# EAGLE design LE1-4 (EAGLE 8.5.1)
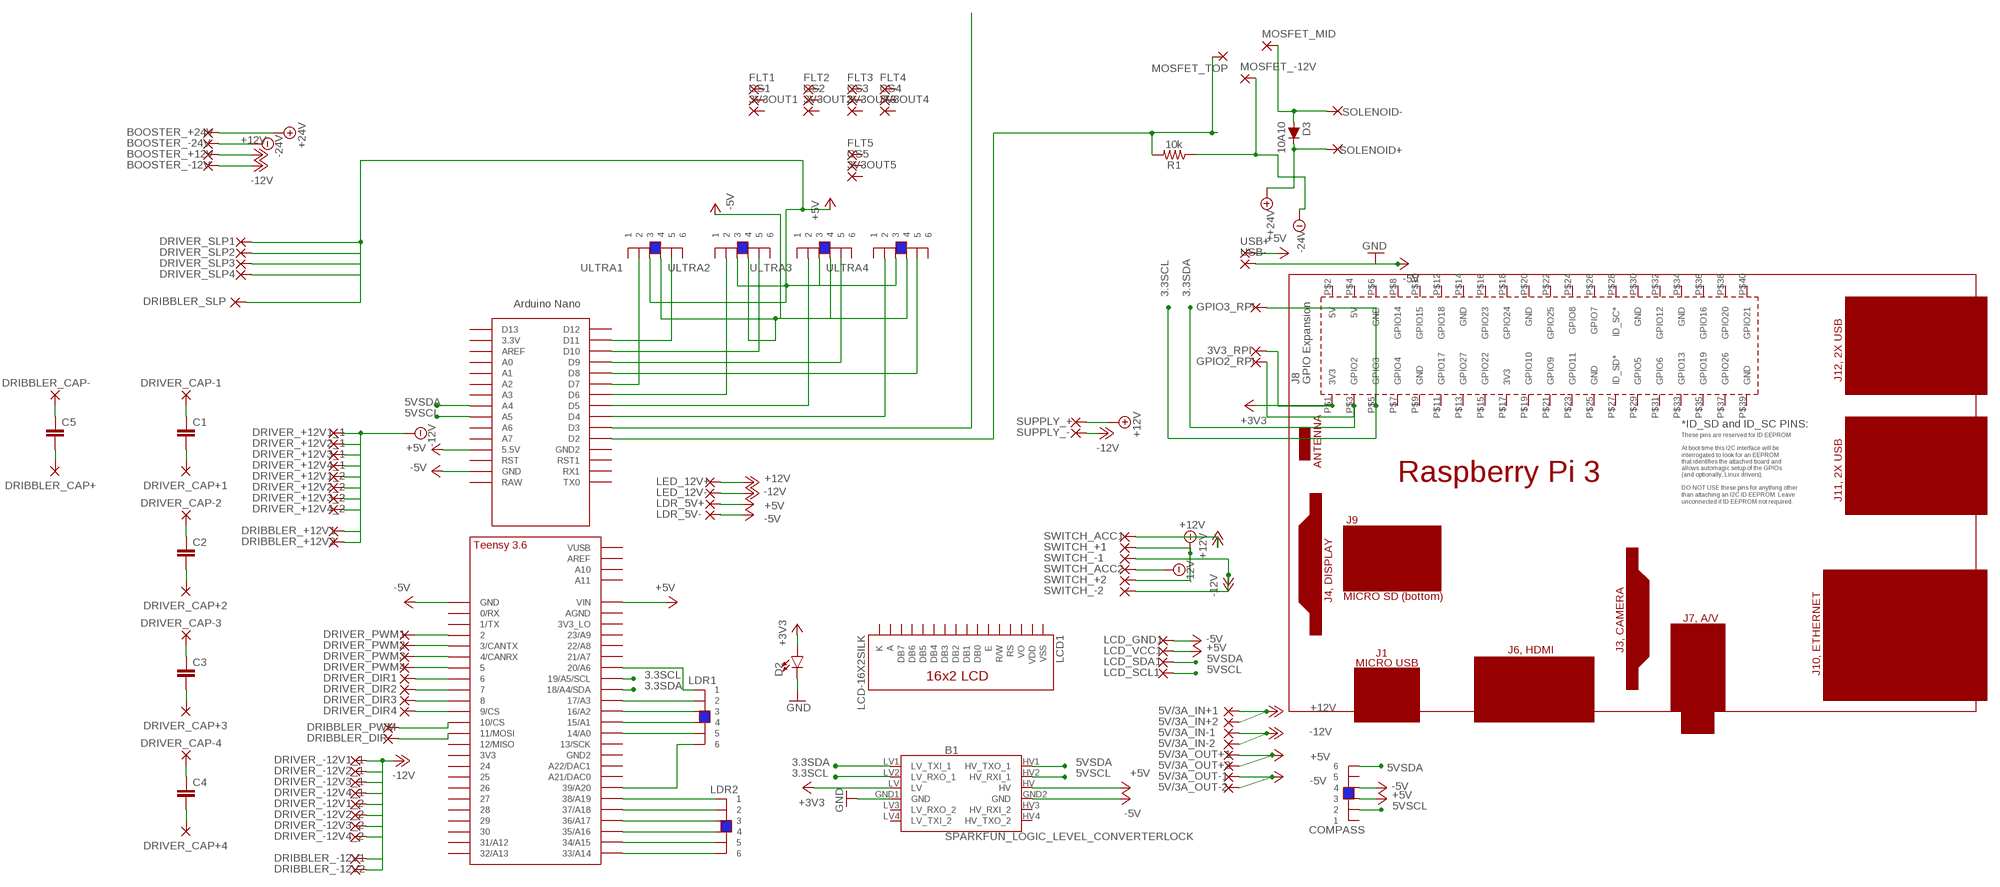
[diagram p0: schematic, sheet 1]

## Parts
3V3_RPI  2,54/1,0  [2,54/1,0]
3V3OUT1  2,54/1,0  [2,54/1,0]
3V3OUT2  2,54/1,0  [2,54/1,0]
3V3OUT3  2,54/1,0  [2,54/1,0]
3V3OUT4  2,54/1,0  [2,54/1,0]
3V3OUT5  2,54/1,0  [2,54/1,0]
5V/3A_IN+1  WIREPAD2,54/1,0  [2,54/1,0]
5V/3A_IN+2  WIREPAD2,54/1,0  [2,54/1,0]
5V/3A_IN-1  WIREPAD2,54/1,0  [2,54/1,0]
5V/3A_IN-2  WIREPAD2,54/1,0  [2,54/1,0]
5V/3A_OUT+1  WIREPAD2,54/1,0  [2,54/1,0]
5V/3A_OUT+2  WIREPAD2,54/1,0  [2,54/1,0]
5V/3A_OUT-1  WIREPAD2,54/1,0  [2,54/1,0]
5V/3A_OUT-2  WIREPAD2,54/1,0  [2,54/1,0]
B1  SPARKFUN_LOGIC_LEVEL_CONVERTERLOCK  [SPARKFUN_LOGIC_LEVEL_CONVERTER_LOCK]
BOOSTER_+12V  WIREPAD2,54/1,0  [2,54/1,0]
BOOSTER_+24V  WIREPAD2,54/1,0  [2,54/1,0]
BOOSTER_-12V  WIREPAD2,54/1,0  [2,54/1,0]
BOOSTER_-24V  WIREPAD2,54/1,0  [2,54/1,0]
C1  C5/7.2  [C5B7.2]
C2  C5/7.2  [C5B7.2]
C3  C5/7.2  [C5B7.2]
C4  C5/7.2  [C5B7.2]
C5  C5/7.2  [C5B7.2]
COMPASS  6P6C_FEMALESMD  [6P6C_FEMALE]
CS1  2,54/1,0  [2,54/1,0]
CS2  2,54/1,0  [2,54/1,0]
CS3  2,54/1,0  [2,54/1,0]
CS4  2,54/1,0  [2,54/1,0]
CS5  2,54/1,0  [2,54/1,0]
D2  LED-3MM-NO_SILK  [LED_3MM-NS]
D3  10A10  DIODE-1N4148  [DIODE-1N4148]
DRIBBLER_+12V1  WIREPAD2,54/1,0  [2,54/1,0]
DRIBBLER_+12V2  WIREPAD2,54/1,0  [2,54/1,0]
DRIBBLER_-12V1  WIREPAD2,54/1,0  [2,54/1,0]
DRIBBLER_-12V2  WIREPAD2,54/1,0  [2,54/1,0]
DRIBBLER_CAP+  2,54/1,0  [2,54/1,0]
DRIBBLER_CAP-  2,54/1,0  [2,54/1,0]
DRIBBLER_DIR  WIREPAD2,54/1,0  [2,54/1,0]
DRIBBLER_PWM  WIREPAD2,54/1,0  [2,54/1,0]
DRIBBLER_SLP  WIREPAD2,54/1,0  [2,54/1,0]
DRIVER_+12V1_1  WIREPAD2,54/1,0  [2,54/1,0]
DRIVER_+12V1_2  WIREPAD2,54/1,0  [2,54/1,0]
DRIVER_+12V2_1  WIREPAD2,54/1,0  [2,54/1,0]
DRIVER_+12V2_2  WIREPAD2,54/1,0  [2,54/1,0]
DRIVER_+12V3_1  WIREPAD2,54/1,0  [2,54/1,0]
DRIVER_+12V3_2  WIREPAD2,54/1,0  [2,54/1,0]
DRIVER_+12V4_1  WIREPAD2,54/1,0  [2,54/1,0]
DRIVER_+12V4_2  WIREPAD2,54/1,0  [2,54/1,0]
DRIVER_-12V1_1  WIREPAD2,54/1,0  [2,54/1,0]
DRIVER_-12V1_2  WIREPAD2,54/1,0  [2,54/1,0]
DRIVER_-12V2_1  WIREPAD2,54/1,0  [2,54/1,0]
DRIVER_-12V2_2  WIREPAD2,54/1,0  [2,54/1,0]
DRIVER_-12V3_1  WIREPAD2,54/1,0  [2,54/1,0]
DRIVER_-12V3_2  WIREPAD2,54/1,0  [2,54/1,0]
DRIVER_-12V4_1  WIREPAD2,54/1,0  [2,54/1,0]
DRIVER_-12V4_2  WIREPAD2,54/1,0  [2,54/1,0]
DRIVER_CAP+1  2,54/1,0  [2,54/1,0]
DRIVER_CAP+2  2,54/1,0  [2,54/1,0]
DRIVER_CAP+3  2,54/1,0  [2,54/1,0]
DRIVER_CAP+4  2,54/1,0  [2,54/1,0]
DRIVER_CAP-1  2,54/1,0  [2,54/1,0]
DRIVER_CAP-2  2,54/1,0  [2,54/1,0]
DRIVER_CAP-3  2,54/1,0  [2,54/1,0]
DRIVER_CAP-4  2,54/1,0  [2,54/1,0]
DRIVER_DIR1  WIREPAD2,54/1,0  [2,54/1,0]
DRIVER_DIR2  WIREPAD2,54/1,0  [2,54/1,0]
DRIVER_DIR3  WIREPAD2,54/1,0  [2,54/1,0]
DRIVER_DIR4  WIREPAD2,54/1,0  [2,54/1,0]
DRIVER_PWM1  WIREPAD2,54/1,0  [2,54/1,0]
DRIVER_PWM2  WIREPAD2,54/1,0  [2,54/1,0]
DRIVER_PWM3  WIREPAD2,54/1,0  [2,54/1,0]
DRIVER_PWM4  WIREPAD2,54/1,0  [2,54/1,0]
DRIVER_SLP1  WIREPAD2,54/1,0  [2,54/1,0]
DRIVER_SLP2  WIREPAD2,54/1,0  [2,54/1,0]
DRIVER_SLP3  WIREPAD2,54/1,0  [2,54/1,0]
DRIVER_SLP4  WIREPAD2,54/1,0  [2,54/1,0]
FLT1  2,54/1,0  [2,54/1,0]
FLT2  2,54/1,0  [2,54/1,0]
FLT3  2,54/1,0  [2,54/1,0]
FLT4  2,54/1,0  [2,54/1,0]
FLT5  2,54/1,0  [2,54/1,0]
GPIO2_RPI  2,54/1,0  [2,54/1,0]
GPIO3_RPI  2,54/1,0  [2,54/1,0]
LCD1  LCD-16X2SILK  [LCD-16X2]
LCD_GND1  WIREPAD2,54/1,0  [2,54/1,0]
LCD_SCL1  WIREPAD2,54/1,0  [2,54/1,0]
LCD_SDA1  WIREPAD2,54/1,0  [2,54/1,0]
LCD_VCC1  WIREPAD2,54/1,0  [2,54/1,0]
LDR1  6P6C_FEMALESMD  [6P6C_FEMALE]
LDR2  6P6C_FEMALESMD  [6P6C_FEMALE]
LDR_5V+  2,54/1,0  [2,54/1,0]
LDR_5V-  2,54/1,0  [2,54/1,0]
LED_12V+  2,54/1,0  [2,54/1,0]
LED_12V-  2,54/1,0  [2,54/1,0]
MOSFET_-12V  2,54/1,0  [2,54/1,0]
MOSFET_MID  2,54/1,0  [2,54/1,0]
MOSFET_TOP  2,54/1,0  [2,54/1,0]
PCB1  RPI3  [RPI3]
R1  10k  10KOHM-HORIZ-1/4W-1%  [AXIAL-0.3]
SOLENOID+  2,54/1,0  [2,54/1,0]
SOLENOID-  2,54/1,0  [2,54/1,0]
SUPPLY_+  WIREPAD2,54/1,0  [2,54/1,0]
SUPPLY_-  WIREPAD2,54/1,0  [2,54/1,0]
SWITCH_+1  WIREPAD2,54/1,0  [2,54/1,0]
SWITCH_+2  WIREPAD2,54/1,0  [2,54/1,0]
SWITCH_-1  WIREPAD2,54/1,0  [2,54/1,0]
SWITCH_-2  WIREPAD2,54/1,0  [2,54/1,0]
SWITCH_ACC1  WIREPAD2,54/1,0  [2,54/1,0]
SWITCH_ACC2  WIREPAD2,54/1,0  [2,54/1,0]
U$1  TEENSY_3.5/3.6_BASIC  [TEENSY_3.5/3.6_BASIC]
U$2  NANO  [NANO]
ULTRA1  6P6C_FEMALESMD  [6P6C_FEMALE]
ULTRA2  6P6C_FEMALESMD  [6P6C_FEMALE]
ULTRA3  6P6C_FEMALESMD  [6P6C_FEMALE]
ULTRA4  6P6C_FEMALESMD  [6P6C_FEMALE]
USB+  2,54/1,0  [2,54/1,0]
USB-  2,54/1,0  [2,54/1,0]

## Nets
3.3SCL: B1.LV2(LV_RXO_1) GPIO3_RPI.1(P) PCB1.P$5(GPIO3) U$1.19/A5/SCL
3.3SDA: B1.LV1(LV_TXI_1) GPIO2_RPI.1(P) PCB1.P$3(GPIO2) U$1.18/A4/SDA
5VSCL: B1.HV2(HV_RXI_1) LCD_SCL1.1(P) U$2.A5
5VSDA: B1.HV1(HV_TXO_1) LCD_SDA1.1(P) U$2.A4
+3V3: 3V3_RPI.1(P) B1.LV D2.A PCB1.P$1(3V3)
+5V: 5V/3A_OUT+1.1(P) 5V/3A_OUT+2.1(P) B1.HV COMPASS.3 DRIBBLER_SLP.1(P) DRIVER_SLP1.1(P) DRIVER_SLP2.1(P) DRIVER_SLP3.1(P) DRIVER_SLP4.1(P) LCD_VCC1.1(P) LDR_5V+.1(P) U$1.VIN U$2.5V(5.5V) ULTRA1.3 ULTRA2.3 ULTRA3.3 ULTRA4.3 USB+.1(P)
+12V: 5V/3A_IN+1.1(P) 5V/3A_IN+2.1(P) BOOSTER_+12V.1(P) D3.C LED_12V+.1(P) SOLENOID+.1(P) SUPPLY_+.1(P) SWITCH_+1.1(P) SWITCH_+2.1(P) SWITCH_ACC1.1(P) ; supply symbol labelled +24V
+24V: BOOSTER_+24V.1(P)
-5V: 5V/3A_OUT-1.1(P) 5V/3A_OUT-2.1(P) B1.GND2(GND) COMPASS.4 LCD_GND1.1(P) LDR_5V-.1(P) U$1.GND U$2.GND ULTRA1.4 ULTRA2.4 ULTRA3.4 ULTRA4.4
-12V: 5V/3A_IN-1.1(P) 5V/3A_IN-2.1(P) BOOSTER_-12V.1(P) DRIBBLER_+12V1.1(P) DRIBBLER_+12V2.1(P) DRIBBLER_-12V1.1(P) DRIBBLER_-12V2.1(P) DRIVER_+12V1_1.1(P) DRIVER_+12V1_2.1(P) DRIVER_+12V2_1.1(P) DRIVER_+12V2_2.1(P) DRIVER_+12V3_1.1(P) DRIVER_+12V3_2.1(P) DRIVER_+12V4_1.1(P) DRIVER_+12V4_2.1(P) DRIVER_-12V1_1.1(P) DRIVER_-12V1_2.1(P) DRIVER_-12V2_1.1(P) DRIVER_-12V2_2.1(P) DRIVER_-12V3_1.1(P) DRIVER_-12V3_2.1(P) DRIVER_-12V4_1.1(P) DRIVER_-12V4_2.1(P) LED_12V-.1(P) MOSFET_-12V.1(P) R1.P$1 SUPPLY_-.1(P) SWITCH_-1.1(P) SWITCH_-2.1(P) SWITCH_ACC2.1(P) ; supply symbol labelled -24V
-24V: BOOSTER_-24V.1(P)
GND: B1.GND1(GND) D2.K(C) USB-.1(P) ; supply symbol labelled -5V
N$1: LDR1.6 U$1.39/A20
N$2: DRIBBLER_PWM.1(P) U$1.10/CS
N$3: DRIBBLER_DIR.1(P) U$1.11/MOSI
N$4: DRIVER_PWM1.1(P) U$1.2
N$5: DRIVER_PWM2.1(P) U$1.3/CANTX
N$6: LDR1.2 U$1.17/A3
N$7: LDR1.3 U$1.16/A2
N$8: LDR1.4 U$1.15/A1
N$9: LDR1.5 U$1.14/A0
N$10: LDR1.1 U$1.20/A6
N$11: DRIVER_PWM3.1(P) U$1.4/CANRX
N$12: D3.A MOSFET_MID.1(P) SOLENOID-.1(P)
N$13: MOSFET_TOP.1(P) R1.P$2 U$2.D2
N$14: DRIVER_PWM4.1(P) U$1.5
N$15: U$2.D3
N$16: C5.1 DRIBBLER_CAP-.1(P)
N$17: DRIVER_DIR1.1(P) U$1.6
N$18: LDR2.1 U$1.38/A19
N$19: LDR2.2 U$1.37/A18
N$20: LDR2.3 U$1.36/A17
N$21: LDR2.4 U$1.35/A16
N$22: LDR2.5 U$1.34/A15
N$23: LDR2.6 U$1.33/A14
N$24: DRIVER_DIR2.1(P) U$1.7
N$25: DRIVER_DIR3.1(P) U$1.8
N$26: DRIVER_DIR4.1(P) U$1.9/CS
N$27: C5.2 DRIBBLER_CAP+.1(P)
N$28: U$2.D11 ULTRA1.5
N$29: U$2.D10 ULTRA2.5
N$30: U$2.D9 ULTRA3.5
N$31: C1.1 DRIVER_CAP-1.1(P)
N$32: C1.2 DRIVER_CAP+1.1(P)
N$33: C2.1 DRIVER_CAP-2.1(P)
N$34: C2.2 DRIVER_CAP+2.1(P)
N$35: C3.1 DRIVER_CAP-3.1(P)
N$36: C3.2 DRIVER_CAP+3.1(P)
N$37: C4.1 DRIVER_CAP-4.1(P)
N$38: C4.2 DRIVER_CAP+4.1(P)
N$39: U$2.D8 ULTRA4.5
N$40: U$2.D7 ULTRA1.2
N$41: U$2.D6 ULTRA2.2
N$42: U$2.D5 ULTRA3.2
N$43: U$2.D4 ULTRA4.2
Unconnected: 3V3OUT1.1(P) 3V3OUT2.1(P) 3V3OUT3.1(P) 3V3OUT4.1(P) 3V3OUT5.1(P) B1.HV3(HV_RXI_2) B1.HV4(HV_TXO_2) B1.LV3(LV_RXO_2) B1.LV4(LV_TXI_2) COMPASS.1 COMPASS.2 COMPASS.5 COMPASS.6 CS1.1(P) CS2.1(P) CS3.1(P) CS4.1(P) CS5.1(P) FLT1.1(P) FLT2.1(P) FLT3.1(P) FLT4.1(P) FLT5.1(P) LCD1.3(VO) LCD1.4(RS) LCD1.5(R/W) LCD1.6(E) LCD1.7(DB0) LCD1.8(DB1) LCD1.9(DB2) LCD1.10(DB3) LCD1.11(DB4) LCD1.12(DB5) LCD1.13(DB6) LCD1.14(DB7) PCB1.P$2(5V) PCB1.P$4(5V) PCB1.P$6(GND) PCB1.P$7(GPIO4) PCB1.P$8(GPIO14) PCB1.P$9(GND) PCB1.P$10(GPIO15) PCB1.P$11(GPIO17) PCB1.P$12(GPIO18) PCB1.P$13(GPIO27) PCB1.P$14(GND) PCB1.P$15(GPIO22) PCB1.P$16(GPIO23) PCB1.P$17(3V3) PCB1.P$18(GPIO24) PCB1.P$19(GPIO10) PCB1.P$20(GND) PCB1.P$21(GPIO9) PCB1.P$22(GPIO25) PCB1.P$23(GPIO11) PCB1.P$24(GPIO8) PCB1.P$25(GND) PCB1.P$26(GPIO7) PCB1.P$27(ID_SD*) PCB1.P$28(ID_SC*) PCB1.P$29(GPIO5) PCB1.P$30(GND) PCB1.P$31(GPIO6) PCB1.P$32(GPIO12) PCB1.P$33(GPIO13) PCB1.P$34(GND) PCB1.P$35(GPIO19) PCB1.P$36(GPIO16) PCB1.P$37(GPIO26) PCB1.P$38(GPIO20) PCB1.P$39(GND) PCB1.P$40(GPIO21) U$1.0/RX U$1.1/TX U$1.3V3 U$1.3V3_LO U$1.12/MISO U$1.13/SCK U$1.21/A7 U$1.21/DAC0(A21/DAC0) U$1.22/A8 U$1.23/A9 U$1.24 U$1.25 U$1.26 U$1.27 U$1.28 U$1.29 U$1.30 U$1.31/A12 U$1.32/A13 U$1.A10 U$1.A11 U$1.A22/DAC1 U$1.AGND U$1.AREF U$1.GND2 U$1.VUSB U$2.3.3V U$2.A0 U$2.A1 U$2.A2 U$2.A3 U$2.A6 U$2.A7 U$2.AREF U$2.D12 U$2.D13 U$2.GND1(GND2) U$2.ICSP1 U$2.ICSP2 U$2.ICSP3 U$2.ICSP4 U$2.ICSP5 U$2.ICSP6 U$2.RAW U$2.RST U$2.RST1 U$2.RX1 U$2.TX0 ULTRA1.1 ULTRA1.6 ULTRA2.1 ULTRA2.6 ULTRA3.1 ULTRA3.6 ULTRA4.1 ULTRA4.6

## Power pins joined to a net without a drawn wire
A: LCD1.15(A)
K: LCD1.16(K)
VDD: LCD1.2(VDD)
VSS: LCD1.1(VSS)

## Library data of the parts
3V3_RPI 3V3OUT1-3V3OUT5 CS1-CS5 DRIBBLER_CAP+ DRIBBLER_CAP- DRIVER_CAP+1-DRIVER_CAP+4 DRIVER_CAP-1-DRIVER_CAP-4 FLT1-FLT5 GPIO2_RPI GPIO3_RPI LDR_5V+ LDR_5V- LED_12V+ LED_12V- MOSFET_-12V MOSFET_MID MOSFET_TOP SOLENOID+ SOLENOID- USB+ USB- = wirepad:2,54/1,0: THROUGH-HOLE PAD
5V/3A_IN+1 5V/3A_IN+2 5V/3A_IN-1 5V/3A_IN-2 5V/3A_OUT+1 5V/3A_OUT+2 5V/3A_OUT-1 5V/3A_OUT-2 BOOSTER_+12V BOOSTER_+24V BOOSTER_-12V BOOSTER_-24V DRIBBLER_+12V1 DRIBBLER_+12V2 DRIBBLER_-12V1 DRIBBLER_-12V2 DRIBBLER_DIR DRIBBLER_PWM DRIBBLER_SLP DRIVER_+12V1_1 DRIVER_+12V1_2 DRIVER_+12V2_1 DRIVER_+12V2_2 DRIVER_+12V3_1 DRIVER_+12V3_2 DRIVER_+12V4_1 DRIVER_+12V4_2 DRIVER_-12V1_1 DRIVER_-12V1_2 DRIVER_-12V2_1 DRIVER_-12V2_2 DRIVER_-12V3_1 DRIVER_-12V3_2 DRIVER_-12V4_1 DRIVER_-12V4_2 DRIVER_DIR1-DRIVER_DIR4 DRIVER_PWM1-DRIVER_PWM4 DRIVER_SLP1-DRIVER_SLP4 LCD_GND1 LCD_SCL1 LCD_SDA1 LCD_VCC1 SUPPLY_+ SUPPLY_- SWITCH_+1 SWITCH_+2 SWITCH_-1 SWITCH_-2 SWITCH_ACC1 SWITCH_ACC2 = wirepad:WIREPAD: Wire PAD connect wire on PCB
B1 = SparkFun-Boards:SPARKFUN_LOGIC_LEVEL_CONVERTER: SparkFun Logic Level Converter -Bi-Directional This is the mechnical outline for the 3.3V - 5V bi directional logic level converter. *Note, the "LOCK" Package has the header pins staggered by an offset of 5 mils (off center line), so that when you slide a row of standard 0.1" headers into the PTH pads, it will hold position vertically. See the follwing turorial for more information on this type of special footprints: Sneaky Footprints <https://www.sparkfun.com/tutorials/114> SparkFun Products: SparkFun Logic Level Converter - Bi-Directional <https://www.sparkfun.com/products/12009>
C1-C5 = capacitor-wima:C: CAPACITOR naming: grid - package width
COMPASS LDR1 LDR2 ULTRA1-ULTRA4 = Yijiano:6P6C_FEMALE
D2 = SparkFun-LED:LED: LED (Generic) Standard schematic elements and footprints for 5mm, 3mm, 1206, and 0603 sized LEDs. Generic LEDs with no color specified.
D3 = SparkFun-DiscreteSemi:DIODE: Diode These are standard reverse protection diodes and small signal diodes. SparkFun Products: SparkFun SparkPunk Sound Kit <https://www.sparkfun.com/products/11177> SparkFun ESP8266 Thing <https://www.sparkfun.com/products/13231>; PROD_ID: DIO-08378; VALUE: 200mA/100V/1V
LCD1 = SparkFun-Displays:LCD-16X2: Standard text-only 16x2 parallel input LCD Basic 16 character by 2 line display. Typically utilizes the extremely common HD44780 parallel interface chipset SparkFun Products: Basic 16x2 Green <https://www.sparkfun.com/products/255> Basic 8x2 Green <https://www.sparkfun.com/products/11122>; SF_ID: LCD-00255
PCB1 = e14_Rpi3_RevA:RPI3: Device for Raspberry Pi 3 board created by Dave Young for www.element14.com More information and support community is available at https://www.element14.com/community/community/raspberry-pi
R1 = SparkFun-Resistors:10KOHM: 10kΩ resistor A resistor is a passive two-terminal electrical component that implements electrical resistance as a circuit element. Resistors act to reduce current flow, and, at the same time, act to lower voltage levels within circuits. - Wikipedia; PROD_ID: RES-12183
U$1 = Teensy356:TEENSY_3.5/3.6_BASIC
U$2 = Arduino-clone:NANO: Arduino Nano

## Board
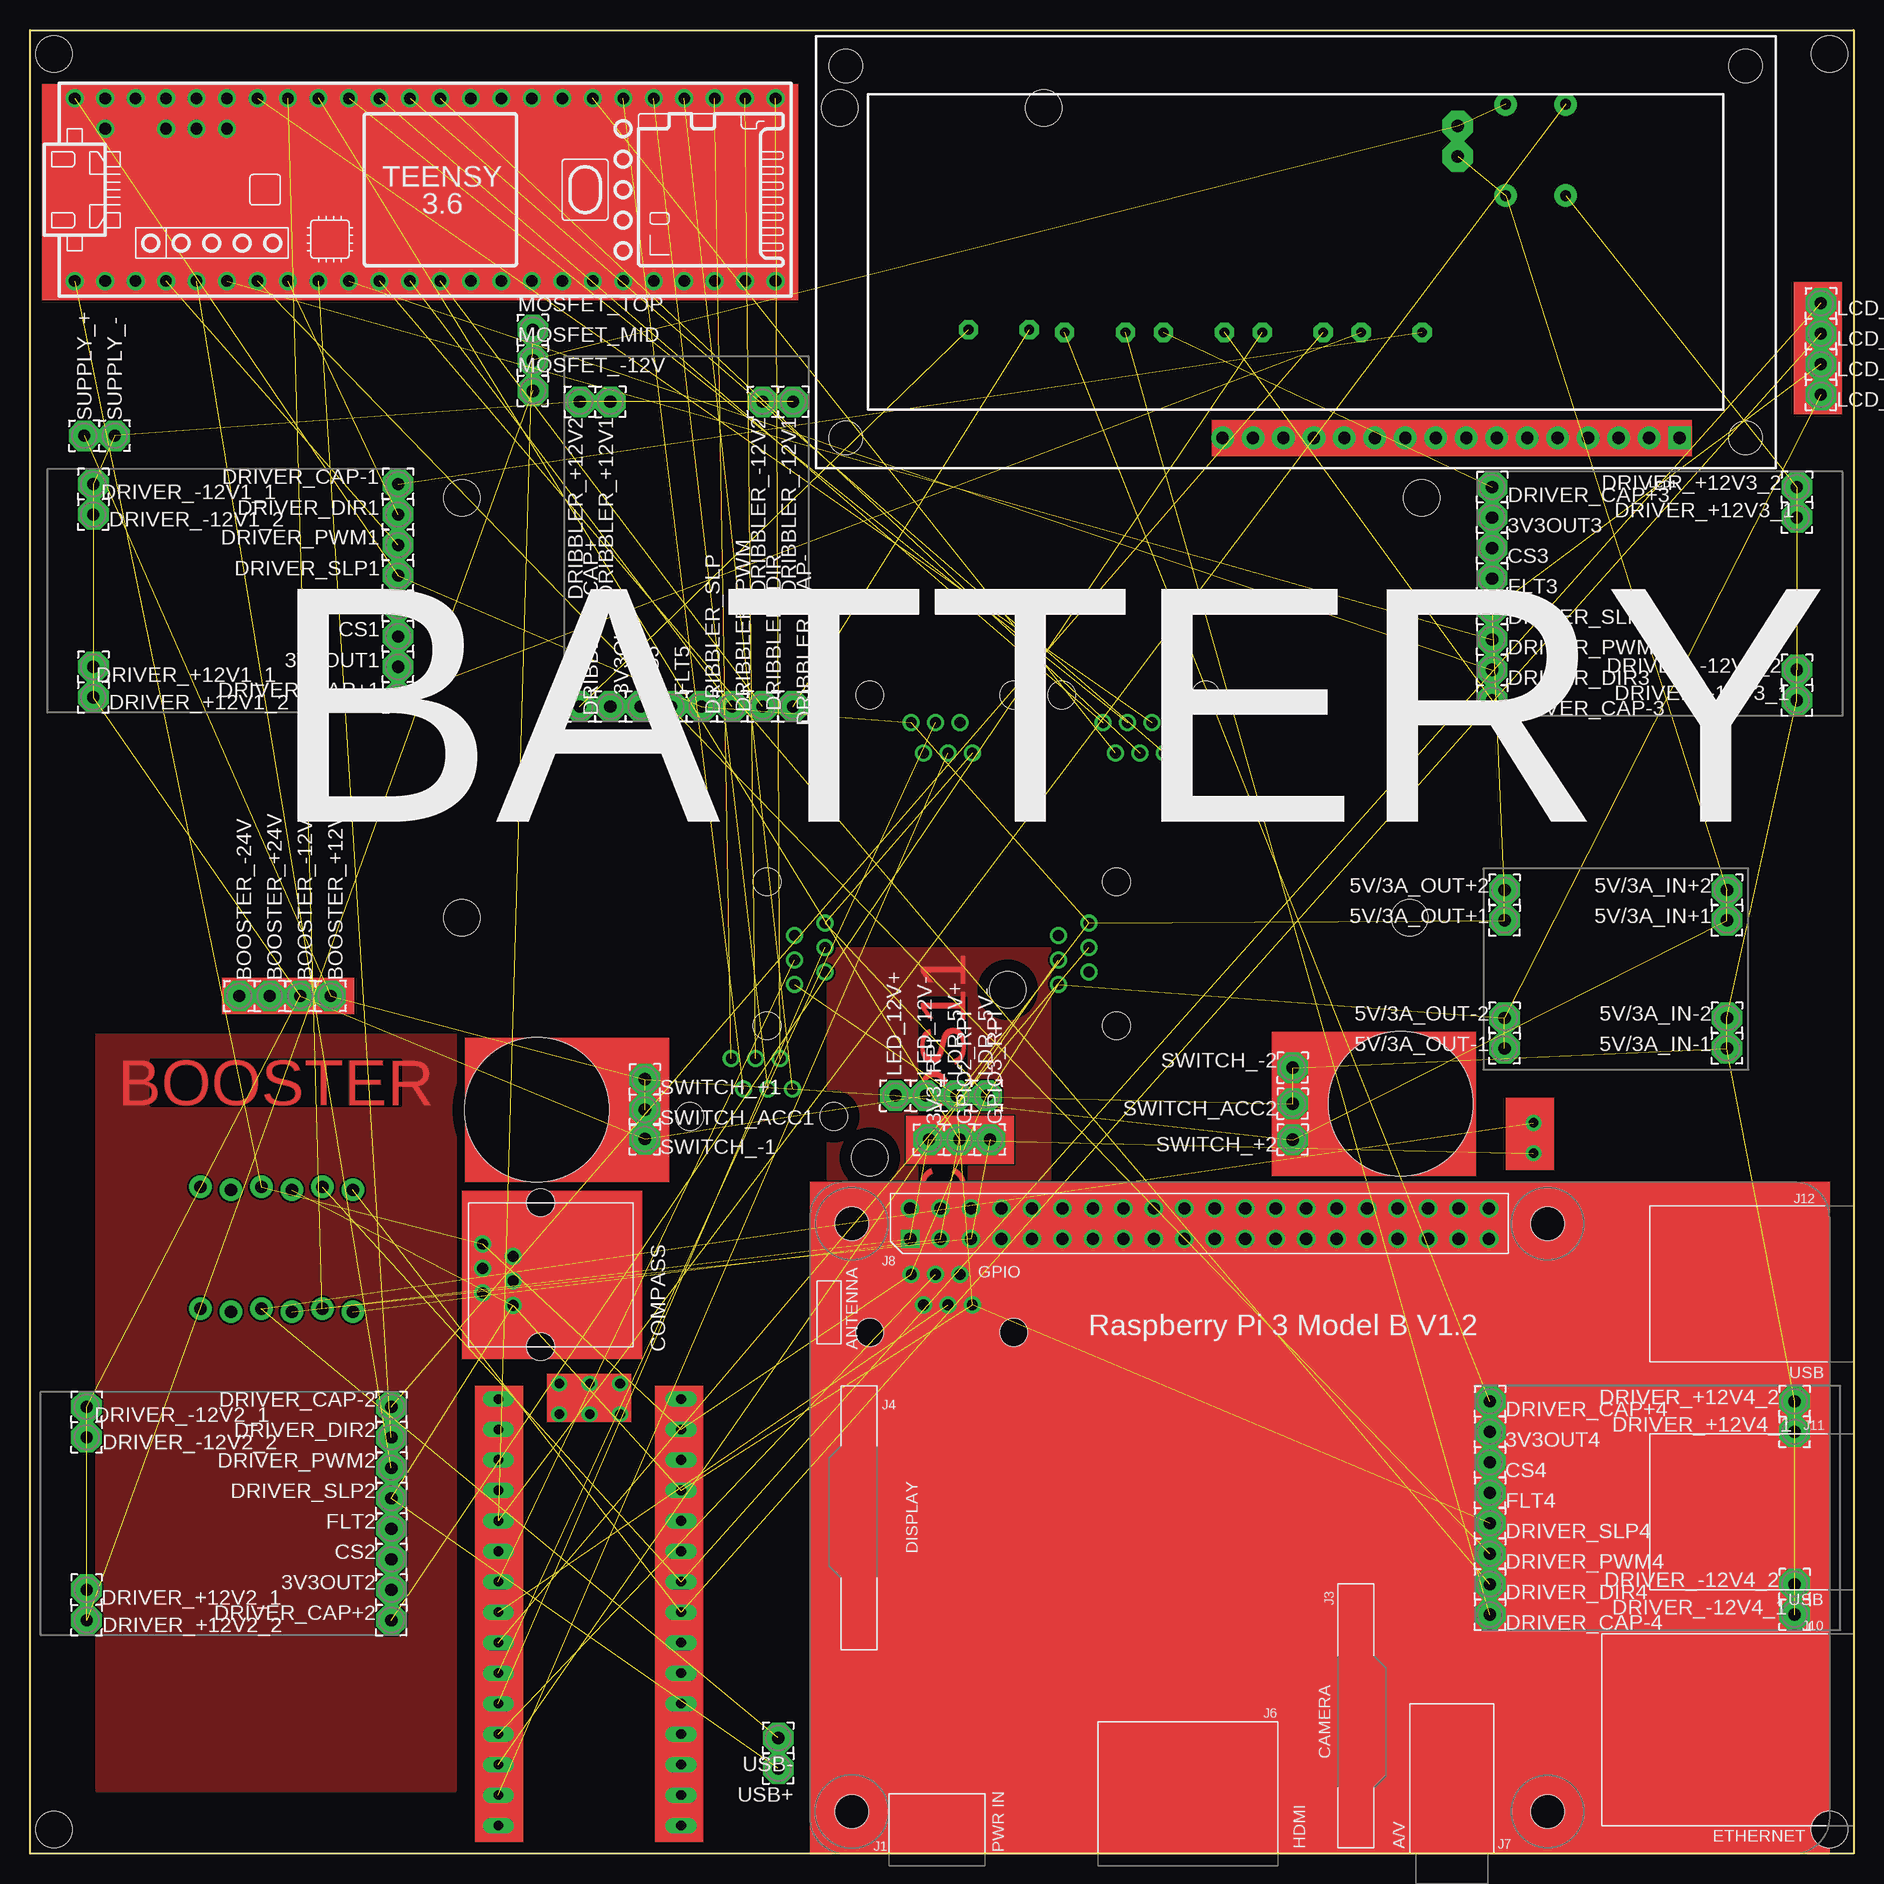
[diagram p1: board, top side]
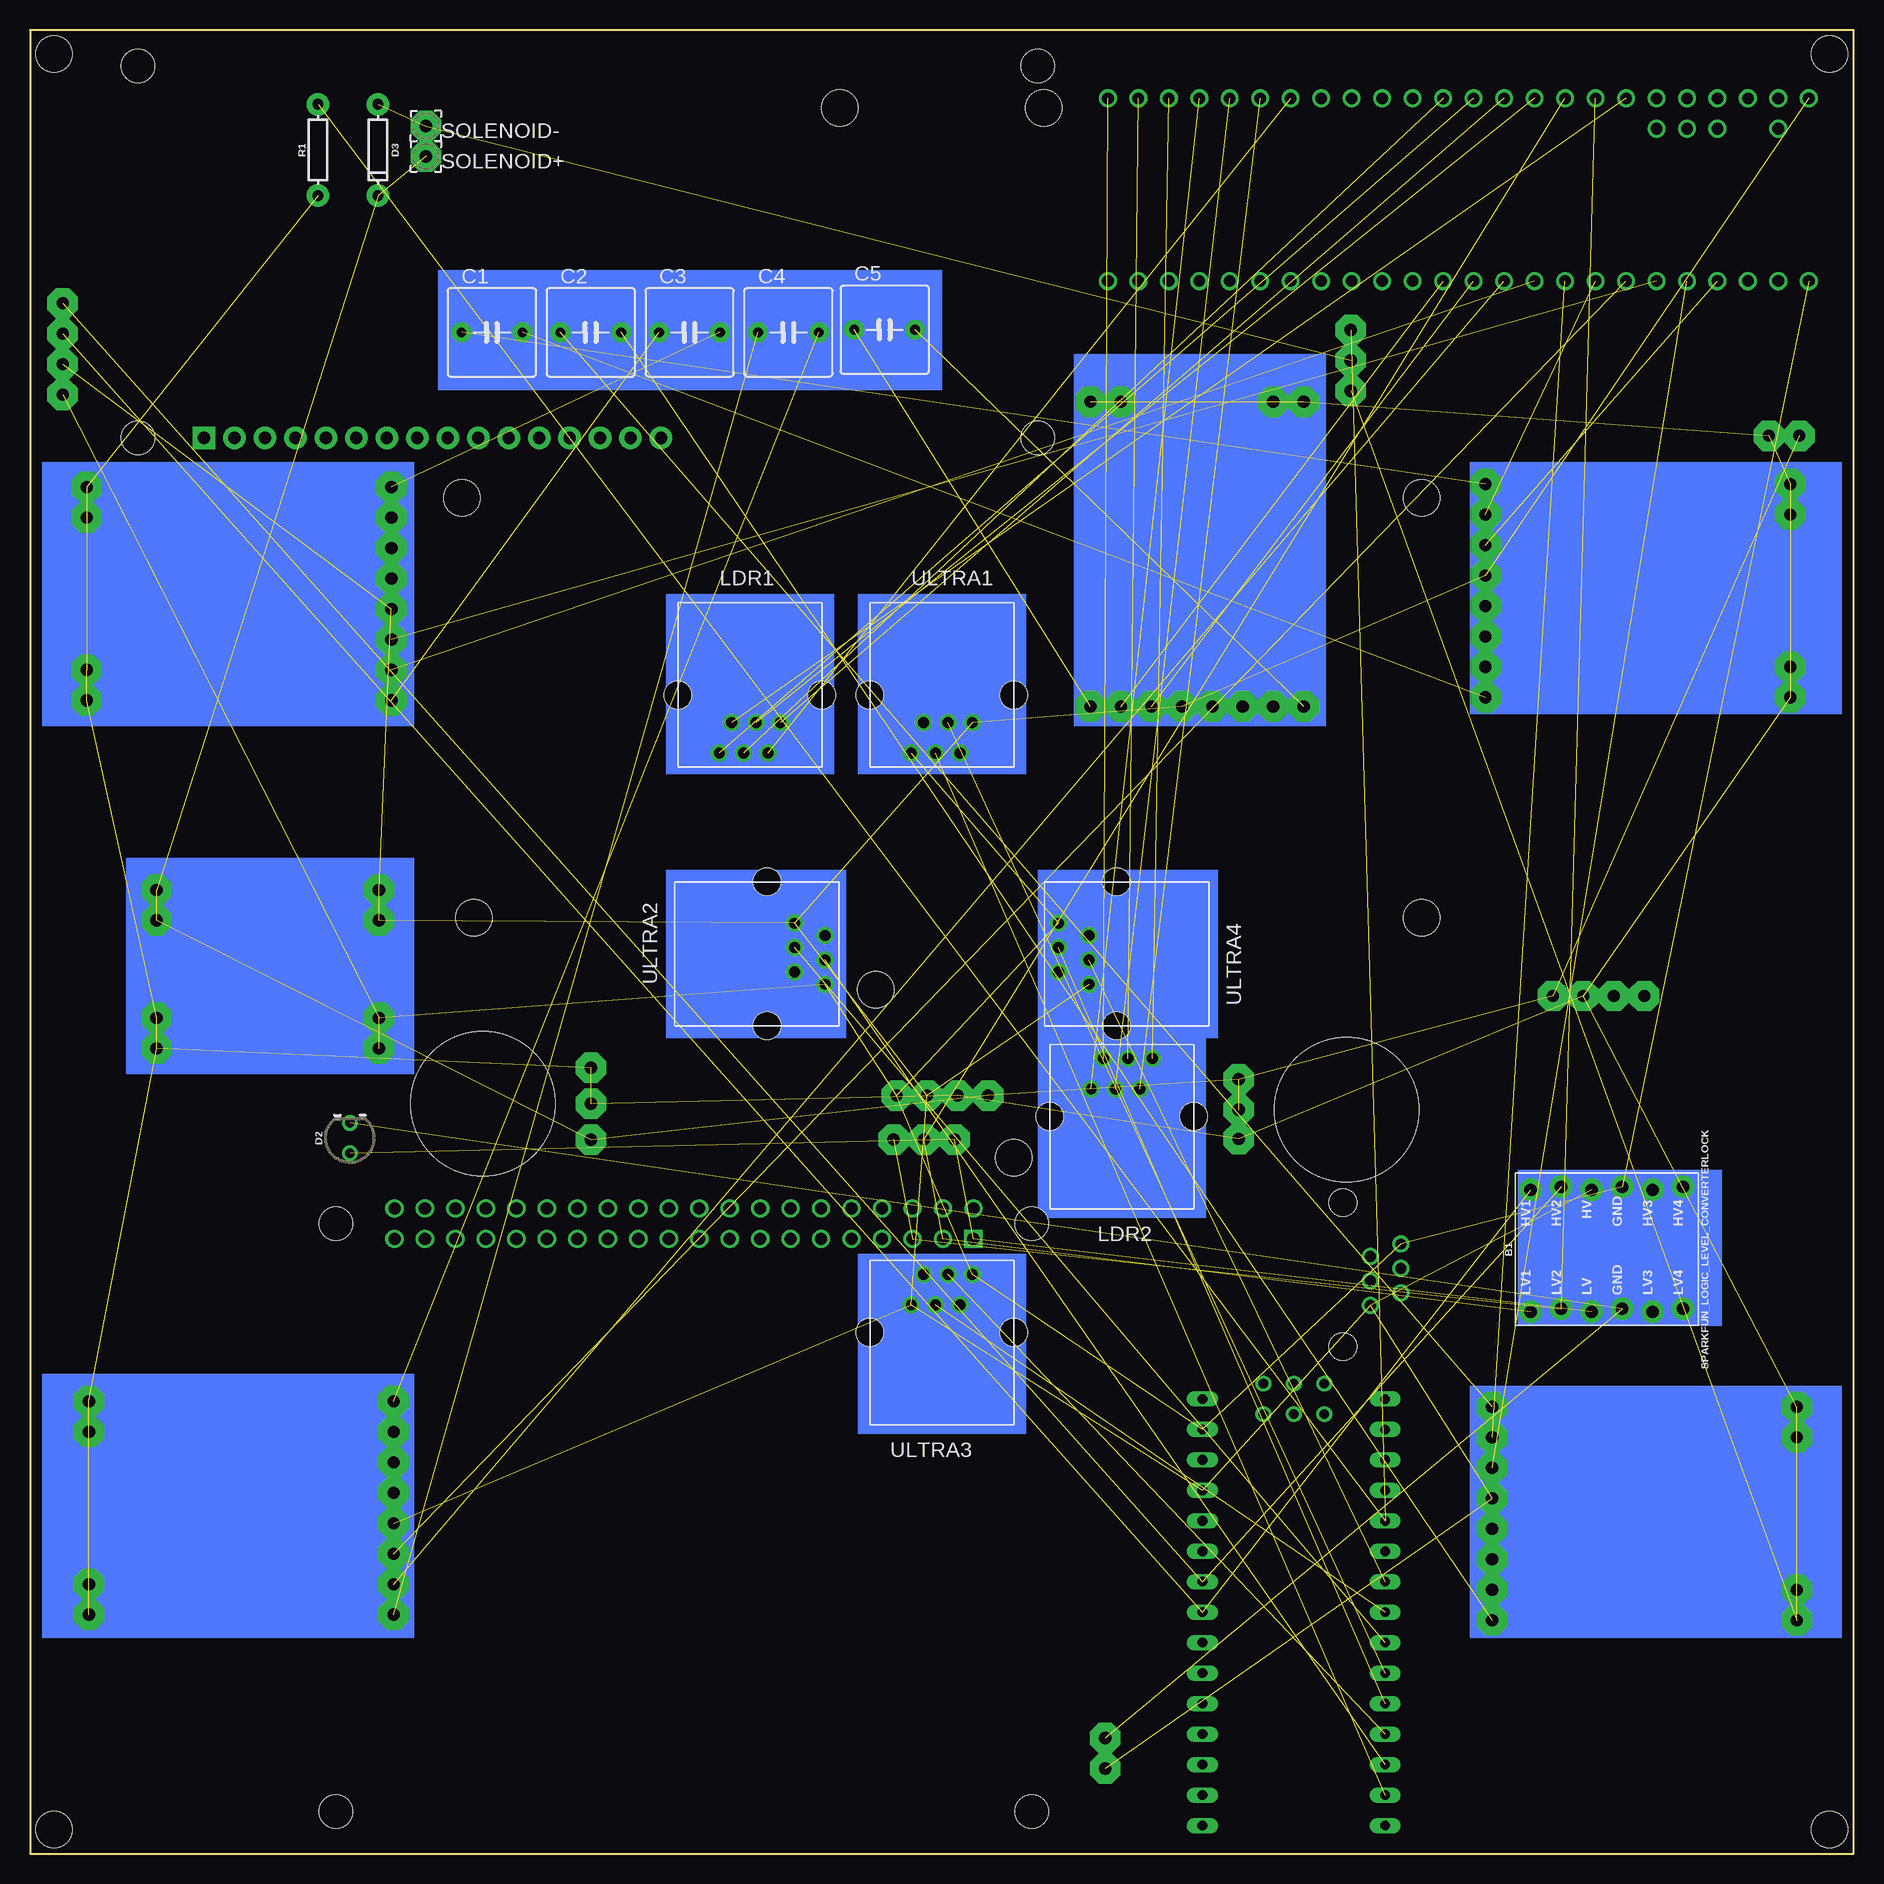
[diagram p2: board, bottom side, seen from below]

Size 152 x 152 mm. Coordinates in mm from the lower left corner, seen from the top.
Outline: 0,0 0,152 152,152 152,0 0,0
Copper layers (1*16): Top 0.035mm / dielectric 1.5mm / Bottom 0.035mm
Design rules "default": minimum track width 6mil, minimum drill 0.35mm, track to track 6mil, track to pad 6mil, pad to pad 6mil, via to via 6mil, smd to smd 6mil, copper to edge 40mil, drill to drill 6mil, minimum pad ring 10mil, minimum via ring 8mil, stop-mask expansion 4mil, vias tented up to drill 0mil, thermal gap 10mil
Holes 12 mm at 42.25,62 114.25,62.5
Holes 3 mm at 2,150 150,150 150,2 2,2 81.5,72 70,58 115,78 116,113 36,113 36,78 67.5,145.5 84.5,145.5

### Footprints (pad centres in the part's own frame; a part is rotated, then mirrored left to right if it is on the bottom)
2,54/1,0 = drill 1.016 pad 2.54 octagon: 1 0,0
SPARKFUN_LOGIC_LEVEL_CONVERTER_LOCK = drill 1.016 pad 1.88: GND1 -4.953,-1.27; GND2 5.207,-1.27; HV 4.953,1.27; HV1 4.953,6.35; HV2 5.207,3.81; HV3 4.953,-3.81; HV4 5.207,-6.35; LV -5.207,1.27; LV1 -5.207,6.35; LV2 -4.953,3.81; LV3 -5.207,-3.81; LV4 -4.953,-6.35
C5B7.2 = drill 0.813 pad 1.6 octagon: 1 -2.54,0; 2 2.54,0
6P6C_FEMALE = drill 0.9 pad 1.3: 1 -1.53,1.27; 2 0.51,1.27; 3 2.55,1.27; 4 -2.55,-1.27; 5 -0.51,-1.27; 6 1.53,-1.27 | hole 2.3: -6,3.57; 6,3.57
LED_3MM-NS = drill 0.813: A -1.27,0; K 1.27,0
DIODE-1N4148 = drill 0.9 pad 1.88: A -3.81,0; C 3.81,0
LCD-16X2 = drill 1.016 pad 1.88 square: 1 -32,15.5 | drill 1.016 pad 1.88: 2 -29.46,15.5; 3 -26.92,15.5; 4 -24.38,15.5; 5 -21.84,15.5; 6 -19.3,15.5; 7 -16.76,15.5; 8 -14.22,15.5; 9 -11.68,15.5; 10 -9.14,15.5; 11 -6.6,15.5; 12 -4.06,15.5; 13 -1.52,15.5; 14 1.02,15.5; 15 3.56,15.5; 16 6.1,15.5 | hole 2.8: -37.5,15.5; -37.5,-15.5; 37.5,15.5; 37.5,-15.5
RPI3 = drill 1.016 square: P$1 8.37,51.23 | drill 1.016: P$2 8.357,53.772; P$3 10.897,51.232; P$4 10.897,53.772; P$5 13.437,51.232; P$6 13.437,53.772; P$7 15.977,51.232; P$8 15.977,53.772; P$9 18.517,51.232; P$10 18.517,53.772; P$11 21.057,51.232; P$12 21.057,53.772; P$13 23.597,51.232; P$14 23.597,53.772; P$15 26.137,51.232; P$16 26.137,53.772; P$17 28.677,51.232; P$18 28.677,53.772; P$19 31.217,51.232; P$20 31.217,53.772; P$21 33.757,51.232; P$22 33.757,53.772; P$23 36.297,51.232; P$24 36.297,53.772; P$25 38.837,51.232; P$26 38.837,53.772; P$27 41.377,51.232; P$28 41.377,53.772; P$29 43.917,51.232; P$30 43.917,53.772; P$31 46.457,51.232; P$32 46.457,53.772; P$33 48.997,51.232; P$34 48.997,53.772; P$35 51.537,51.232; P$36 51.537,53.772; P$37 54.077,51.232; P$38 54.077,53.772; P$39 56.617,51.232; P$40 56.617,53.772 | hole 2.75: 3.5,3.5; 61.5,3.5; 3.5,52.5; 61.5,52.5
AXIAL-0.3 = drill 0.9 pad 1.88: P$1 -3.81,0; P$2 3.81,0
TEENSY_3.5/3.6_BASIC = drill 0.965: 0/RX -25.4,-7.62; 1/TX -22.86,-7.62; 2 -20.32,-7.62; 3/CANTX -17.78,-7.62; 3V3 7.62,-7.62; 3V3_LO -22.86,7.62; 4/CANRX -15.24,-7.62; 5 -12.7,-7.62; 6 -10.16,-7.62; 7 -7.62,-7.62; 8 -5.08,-7.62; 9/CS -2.54,-7.62; 10/CS 0,-7.62; 11/MOSI 2.54,-7.62; 12/MISO 5.08,-7.62; 13/SCK 5.08,7.62; 14/A0 2.54,7.62; 15/A1 0,7.62; 16/A2 -2.54,7.62; 17/A3 -5.08,7.62; 18/A4/SDA -7.62,7.62; 19/A5/SCL -10.16,7.62; 20/A6 -12.7,7.62; 21/A7 -15.24,7.62; 21/DAC0 12.7,7.62; 22/A8 -17.78,7.62; 23/A9 -20.32,7.62; 24 10.16,-7.62; 25 12.7,-7.62; 26 15.24,-7.62; 27 17.78,-7.62; 28 20.32,-7.62; 29 22.86,-7.62; 30 25.4,-7.62; 31/A12 27.94,-7.62; 32/A13 30.48,-7.62; 33/A14 30.48,7.62; 34/A15 27.94,7.62; 35/A16 25.4,7.62; 36/A17 22.86,7.62; 37/A18 20.32,7.62; 38/A19 17.78,7.62; 39/A20 15.24,7.62; A10 -17.78,5.08; A11 -15.24,5.08; A22/DAC1 10.16,7.62; AGND -25.4,7.62; AREF -20.32,5.08; GND -27.94,-7.62; GND2 7.62,7.62; VIN -27.94,7.62; VUSB -25.4,5.08
NANO = drill 0.8 long: 3.3V -10.16,24.13; 5V -10.16,-1.27; A0 -10.16,19.05; A1 -10.16,16.51; A2 -10.16,13.97; A3 -10.16,11.43; A4 -10.16,8.89; A5 -10.16,6.35; A6 -10.16,3.81; A7 -10.16,1.27; AREF -10.16,21.59; D2 5.08,1.27; D3 5.08,3.81; D4 5.08,6.35; D5 5.08,8.89; D6 5.08,11.43; D7 5.08,13.97; D8 5.08,16.51; D9 5.08,19.05; D10 5.08,21.59; D11 5.08,24.13; D12 5.08,26.67; D13 -10.16,26.67; GND -10.16,-6.35; GND1 5.08,-1.27; RAW -10.16,-8.89; RST -10.16,-3.81; RST1 5.08,-3.81; RX1 5.08,-6.35; TX0 5.08,-8.89 | drill 0.8: ICSP1 -5.08,-10.16; ICSP2 -5.08,-7.62; ICSP3 -2.54,-10.16; ICSP4 -2.54,-7.62; ICSP5 0,-10.16; ICSP6 0,-7.62

### Placement (x,y rotation side)
3V3_RPI  74.93,59.52 90 top
3V3OUT1  30.68,98.91 180 top
3V3OUT2  30.12,21.99 180 top
3V3OUT3  121.88,111.36 0 top
3V3OUT4  121.69,35.15 0 top
3V3OUT5  48.37,95.61 270 top
5V/3A_IN+1  141.46,77.78 180 top
5V/3A_IN+2  141.46,80.32 180 top
5V/3A_IN-1  141.46,67.12 180 top
5V/3A_IN-2  141.46,69.66 180 top
5V/3A_OUT+1  122.91,77.78 180 top
5V/3A_OUT+2  122.91,80.32 180 top
5V/3A_OUT-1  122.91,67.12 180 top
5V/3A_OUT-2  122.91,69.66 180 top
B1  20.56,50.37 90 bottom
BOOSTER_+12V  25.06,71.48 90 top
BOOSTER_+24V  19.98,71.48 90 top
BOOSTER_-12V  22.52,71.48 90 top
BOOSTER_-24V  17.44,71.48 90 top
C1  113.5,126.8 0 bottom
C2  105.26,126.8 0 bottom
C3  97.02,126.8 0 bottom
C4  88.78,126.8 0 bottom
C5  80.76,127.02 0 bottom
COMPASS  39,48.25 270 top
CS1  30.68,101.45 180 top
CS2  30.12,24.53 180 top
CS3  121.88,108.82 0 top
CS4  121.69,32.61 0 top
CS5  50.91,95.61 270 top
D2  125.33,59.64 90 bottom
D3  123,142 270 bottom
DRIBBLER_+12V1  48.37,121.01 270 top
DRIBBLER_+12V2  45.83,121.01 270 top
DRIBBLER_-12V1  63.61,121.01 270 top
DRIBBLER_-12V2  61.07,121.01 270 top
DRIBBLER_CAP+  45.83,95.61 270 top
DRIBBLER_CAP-  63.61,95.61 270 top
DRIBBLER_DIR  61.07,95.61 270 top
DRIBBLER_PWM  58.53,95.61 270 top
DRIBBLER_SLP  55.99,95.61 270 top
DRIVER_+12V1_1  5.28,98.91 180 top
DRIVER_+12V1_2  5.28,96.37 0 top
DRIVER_+12V2_1  4.72,21.99 180 top
DRIVER_+12V2_2  4.72,19.45 0 top
DRIVER_+12V3_1  147.28,111.36 0 top
DRIVER_+12V3_2  147.28,113.9 180 top
DRIVER_+12V4_1  147.09,35.15 0 top
DRIVER_+12V4_2  147.09,37.69 180 top
DRIVER_-12V1_1  5.28,114.15 180 top
DRIVER_-12V1_2  5.28,111.61 0 top
DRIVER_-12V2_1  4.72,37.23 180 top
DRIVER_-12V2_2  4.72,34.69 0 top
DRIVER_-12V3_1  147.28,96.12 0 top
DRIVER_-12V3_2  147.28,98.66 180 top
DRIVER_-12V4_1  147.09,19.91 0 top
DRIVER_-12V4_2  147.09,22.45 180 top
DRIVER_CAP+1  30.68,96.37 180 top
DRIVER_CAP+2  30.12,19.45 180 top
DRIVER_CAP+3  121.88,113.9 0 top
DRIVER_CAP+4  121.69,37.69 0 top
DRIVER_CAP-1  30.68,114.15 180 top
DRIVER_CAP-2  30.12,37.23 180 top
DRIVER_CAP-3  121.88,96.12 0 top
DRIVER_CAP-4  121.69,19.91 0 top
DRIVER_DIR1  30.68,111.61 180 top
DRIVER_DIR2  30.12,34.69 180 top
DRIVER_DIR3  121.88,98.66 0 top
DRIVER_DIR4  121.69,22.45 0 top
DRIVER_PWM1  30.68,109.07 180 top
DRIVER_PWM2  30.12,32.15 180 top
DRIVER_PWM3  121.88,101.2 0 top
DRIVER_PWM4  121.69,24.99 0 top
DRIVER_SLP1  30.68,106.53 180 top
DRIVER_SLP2  30.12,29.61 180 top
DRIVER_SLP3  121.88,103.74 0 top
DRIVER_SLP4  121.69,27.53 0 top
FLT1  30.68,103.99 180 top
FLT2  30.12,27.07 180 top
FLT3  121.88,106.28 0 top
FLT4  121.69,30.07 0 top
FLT5  53.45,95.61 270 top
GPIO2_RPI  77.47,59.52 90 top
GPIO3_RPI  80.01,59.52 90 top
LCD1  105.5,133.5 180 top
LCD_GND1  149.28,121.6 0 top
LCD_SCL1  149.28,129.22 0 top
LCD_SDA1  149.28,126.68 0 top
LCD_VCC1  149.28,124.14 0 top
LDR1  92,93 0 bottom
LDR2  61,65 180 bottom
LDR_5V+  77.22,63.18 90 top
LDR_5V-  79.76,63.18 90 top
LED_12V+  72.14,63.18 90 top
LED_12V-  74.68,63.18 90 top
MOSFET_-12V  41.91,121.92 0 top
MOSFET_MID  41.91,124.46 0 top
MOSFET_TOP  41.91,127 0 top
PCB1  65,0 0 top
R1  128,142 90 bottom
SOLENOID+  119,141.46 0 bottom
SOLENOID-  119,144 0 bottom
SUPPLY_+  4.52,118.18 90 top
SUPPLY_-  7.06,118.18 90 top
SWITCH_+1  51.25,64.54 0 top
SWITCH_+2  105.25,59.5 180 top
SWITCH_-1  51.25,59.56 0 top
SWITCH_-2  105.25,65.5 180 top
SWITCH_ACC1  51.25,62 0 top
SWITCH_ACC2  105.25,62.5 180 top
U$1  31.67,138.69 0 top
U$2  44.11,29 180 top
ULTRA1  76,93 0 bottom
ULTRA2  87,75 90 bottom
ULTRA3  76,47 180 bottom
ULTRA4  65,75 270 bottom
USB+  62.37,7.09 180 top
USB-  62.37,9.63 180 top

### Tracks (layer width: path | path; a pad name or v marks a point on that pad's centre or on a via)
3.3SCL  (3 unrouted)
3.3SDA  (3 unrouted)
5VSCL  (2 unrouted)
5VSDA  (2 unrouted)
+3V3  (3 unrouted)
+5V  (17 unrouted)
+12V  (9 unrouted)
-5V  (11 unrouted)
-12V  (29 unrouted)
GND  (2 unrouted)
N$1  (1 unrouted)
N$2  (1 unrouted)
N$3  (1 unrouted)
N$4  (1 unrouted)
N$5  (1 unrouted)
N$6  (1 unrouted)
N$7  (1 unrouted)
N$8  (1 unrouted)
N$9  (1 unrouted)
N$10  (1 unrouted)
N$11  (1 unrouted)
N$12  (2 unrouted)
N$13  (2 unrouted)
N$14  (1 unrouted)
N$16  (1 unrouted)
N$17  (1 unrouted)
N$18  (1 unrouted)
N$19  (1 unrouted)
N$20  (1 unrouted)
N$21  (1 unrouted)
N$22  (1 unrouted)
N$23  (1 unrouted)
N$24  (1 unrouted)
N$25  (1 unrouted)
N$26  (1 unrouted)
N$27  (1 unrouted)
N$28  (1 unrouted)
N$29  (1 unrouted)
N$30  (1 unrouted)
N$31  (1 unrouted)
N$32  (1 unrouted)
N$33  (1 unrouted)
N$34  (1 unrouted)
N$35  (1 unrouted)
N$36  (1 unrouted)
N$37  (1 unrouted)
N$38  (1 unrouted)
N$39  (1 unrouted)
N$40  (1 unrouted)
N$41  (1 unrouted)
N$42  (1 unrouted)
N$43  (1 unrouted)
N$44
  pour Top: 35.5,5.25 35.5,68.25 5.5,68.25 5.5,5.25
N$45
  pour Top: 66.5,75.5 85,75.5 85,51 66.5,51
(copper drawn outside any net)
  shapes: Bottom area x14, Top area x13

### Text on the board
Top: BOOSTER | CMPS11
tPlace: BATTERY
tDocu: DRIBBLER | DRIVER1 | DRIVER3 | DRIVER2 | DRIVER4